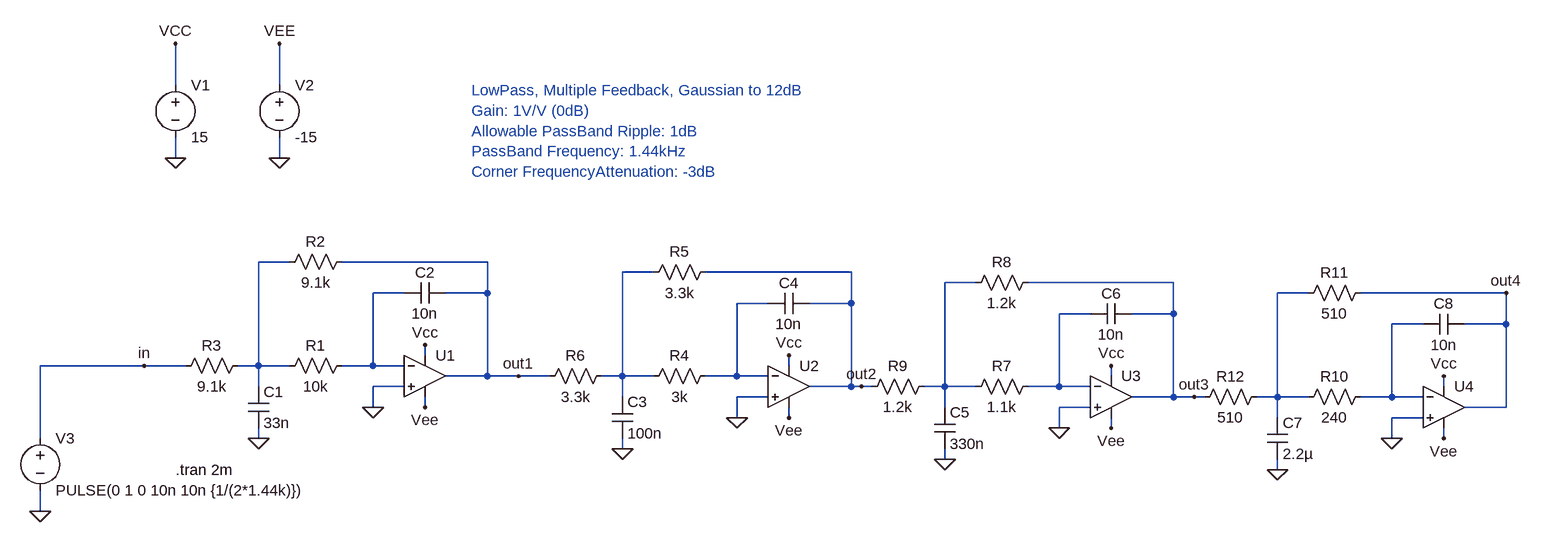
[diagram p0: schematic gaussFilter.asc]
gaussFilter.asc, the LTspice schematic file:
Version 4
SHEET 1 1868 680
WIRE -224 -144 -224 -208
WIRE -64 -144 -64 -208
WIRE -224 -32 -224 -64
WIRE -64 -32 -64 -64
WIRE -48 128 -96 128
WIRE 256 128 32 128
WIRE 512 144 464 144
WIRE 816 144 592 144
WIRE 1008 160 960 160
WIRE 1312 160 1088 160
WIRE 128 176 80 176
WIRE 256 176 256 128
WIRE 256 176 192 176
WIRE 1520 176 1472 176
WIRE 1824 176 1600 176
WIRE 688 192 640 192
WIRE 816 192 816 144
WIRE 816 192 752 192
WIRE 1184 208 1136 208
WIRE 1312 208 1312 160
WIRE 1312 208 1248 208
WIRE 1696 224 1648 224
WIRE 1824 224 1824 176
WIRE 1824 224 1760 224
WIRE 160 272 160 256
WIRE -272 288 -432 288
WIRE -208 288 -272 288
WIRE -96 288 -96 128
WIRE -96 288 -128 288
WIRE -48 288 -96 288
WIRE 80 288 80 176
WIRE 80 288 32 288
WIRE 128 288 80 288
WIRE 720 288 720 272
WIRE 256 304 256 176
WIRE 256 304 192 304
WIRE 304 304 256 304
WIRE 352 304 304 304
WIRE 464 304 464 144
WIRE 464 304 432 304
WIRE 512 304 464 304
WIRE 640 304 640 192
WIRE 640 304 592 304
WIRE 688 304 640 304
WIRE 1216 304 1216 288
WIRE -96 320 -96 288
WIRE 128 320 80 320
WIRE 816 320 816 192
WIRE 816 320 752 320
WIRE 832 320 816 320
WIRE 848 320 832 320
WIRE 960 320 960 160
WIRE 960 320 928 320
WIRE 1008 320 960 320
WIRE 1136 320 1136 208
WIRE 1136 320 1088 320
WIRE 1184 320 1136 320
WIRE 1728 320 1728 304
WIRE 464 336 464 304
WIRE 688 336 640 336
WIRE 1312 336 1312 208
WIRE 1312 336 1248 336
WIRE 1344 336 1312 336
WIRE 1360 336 1344 336
WIRE 1472 336 1472 176
WIRE 1472 336 1440 336
WIRE 1520 336 1472 336
WIRE 1648 336 1648 224
WIRE 1648 336 1600 336
WIRE 1696 336 1648 336
WIRE 80 352 80 320
WIRE 160 352 160 336
WIRE 960 352 960 320
WIRE 1184 352 1136 352
WIRE 1824 352 1824 224
WIRE 1824 352 1760 352
WIRE 640 368 640 336
WIRE 720 368 720 352
WIRE 1472 368 1472 336
WIRE 1696 368 1648 368
WIRE 1136 384 1136 352
WIRE 1216 384 1216 368
WIRE -432 400 -432 288
WIRE -96 400 -96 384
WIRE 1648 400 1648 368
WIRE 1728 400 1728 384
WIRE 464 416 464 400
WIRE 960 432 960 416
WIRE 1472 448 1472 432
WIRE -432 512 -432 480
FLAG 160 256 Vcc
FLAG 160 352 Vee
FLAG -224 -32 0
FLAG -64 -32 0
FLAG -224 -208 VCC
FLAG -64 -208 VEE
FLAG -96 400 0
FLAG 80 352 0
FLAG 720 272 Vcc
FLAG 720 368 Vee
FLAG 464 416 0
FLAG 640 368 0
FLAG 1216 288 Vcc
FLAG 1216 384 Vee
FLAG 960 432 0
FLAG 1136 384 0
FLAG 1728 304 Vcc
FLAG 1728 400 Vee
FLAG 1472 448 0
FLAG 1648 400 0
FLAG -272 288 in
FLAG 304 304 out1
FLAG 832 320 out2
FLAG 1344 336 out3
FLAG 1824 176 out4
FLAG -432 512 0
SYMBOL Opamps\\UniversalOpamp2 160 304 R0
SYMATTR InstName U1
SYMBOL voltage -224 -160 R0
WINDOW 123 0 0 Left 2
WINDOW 39 0 0 Left 2
SYMATTR InstName V1
SYMATTR Value 15
SYMBOL voltage -64 -160 R0
WINDOW 123 0 0 Left 2
WINDOW 39 0 0 Left 2
SYMATTR InstName V2
SYMATTR Value -15
SYMBOL res 48 272 R90
WINDOW 0 0 56 VBottom 2
WINDOW 3 32 56 VTop 2
SYMATTR InstName R1
SYMATTR Value 10k
SYMBOL res 48 112 R90
WINDOW 0 0 56 VBottom 2
WINDOW 3 32 56 VTop 2
SYMATTR InstName R2
SYMATTR Value 9.1k
SYMBOL res -112 272 R90
WINDOW 0 0 56 VBottom 2
WINDOW 3 32 56 VTop 2
SYMATTR InstName R3
SYMATTR Value 9.1k
SYMBOL cap -112 320 R0
SYMATTR InstName C1
SYMATTR Value 33n
SYMBOL cap 192 160 R90
WINDOW 0 0 32 VBottom 2
WINDOW 3 32 32 VTop 2
SYMATTR InstName C2
SYMATTR Value 10n
SYMBOL Opamps\\UniversalOpamp2 720 320 R0
SYMATTR InstName U2
SYMBOL res 608 288 R90
WINDOW 0 0 56 VBottom 2
WINDOW 3 32 56 VTop 2
SYMATTR InstName R4
SYMATTR Value 3k
SYMBOL res 608 128 R90
WINDOW 0 0 56 VBottom 2
WINDOW 3 32 56 VTop 2
SYMATTR InstName R5
SYMATTR Value 3.3k
SYMBOL res 448 288 R90
WINDOW 0 0 56 VBottom 2
WINDOW 3 32 56 VTop 2
SYMATTR InstName R6
SYMATTR Value 3.3k
SYMBOL cap 448 336 R0
SYMATTR InstName C3
SYMATTR Value 100n
SYMBOL cap 752 176 R90
WINDOW 0 0 32 VBottom 2
WINDOW 3 32 32 VTop 2
SYMATTR InstName C4
SYMATTR Value 10n
SYMBOL Opamps\\UniversalOpamp2 1216 336 R0
SYMATTR InstName U3
SYMBOL res 1104 304 R90
WINDOW 0 0 56 VBottom 2
WINDOW 3 32 56 VTop 2
SYMATTR InstName R7
SYMATTR Value 1.1k
SYMBOL res 1104 144 R90
WINDOW 0 0 56 VBottom 2
WINDOW 3 32 56 VTop 2
SYMATTR InstName R8
SYMATTR Value 1.2k
SYMBOL res 944 304 R90
WINDOW 0 0 56 VBottom 2
WINDOW 3 32 56 VTop 2
SYMATTR InstName R9
SYMATTR Value 1.2k
SYMBOL cap 944 352 R0
SYMATTR InstName C5
SYMATTR Value 330n
SYMBOL cap 1248 192 R90
WINDOW 0 0 32 VBottom 2
WINDOW 3 32 32 VTop 2
SYMATTR InstName C6
SYMATTR Value 10n
SYMBOL Opamps\\UniversalOpamp2 1728 352 R0
SYMATTR InstName U4
SYMBOL res 1616 320 R90
WINDOW 0 0 56 VBottom 2
WINDOW 3 32 56 VTop 2
SYMATTR InstName R10
SYMATTR Value 240
SYMBOL res 1616 160 R90
WINDOW 0 0 56 VBottom 2
WINDOW 3 32 56 VTop 2
SYMATTR InstName R11
SYMATTR Value 510
SYMBOL res 1456 320 R90
WINDOW 0 0 56 VBottom 2
WINDOW 3 32 56 VTop 2
SYMATTR InstName R12
SYMATTR Value 510
SYMBOL cap 1456 368 R0
SYMATTR InstName C7
SYMATTR Value 2.2µ
SYMBOL cap 1760 208 R90
WINDOW 0 0 32 VBottom 2
WINDOW 3 32 32 VTop 2
SYMATTR InstName C8
SYMATTR Value 10n
SYMBOL voltage -432 384 R0
WINDOW 123 0 0 Left 2
WINDOW 39 0 0 Left 2
SYMATTR InstName V3
SYMATTR Value PULSE(0 1 0 10n 10n {1/(2*1.44k)})
TEXT -224 448 Left 2 !.tran 2m
TEXT 232 -136 Left 2 ;LowPass, Multiple Feedback, Gaussian to 12dB\nGain: 1V/V (0dB)\nAllowable PassBand Ripple: 1dB\nPassBand Frequency: 1.44kHz\nCorner FrequencyAttenuation: -3dB

The netlist it stands for:
* gaussFilter.asc
XU1 0 N004 Vcc Vee out1 level.2 Avol=1Meg GBW=10Meg Slew=10Meg ilimit=25m rail=0 Vos=0 phimargin=45 en=0 enk=0 in=0 ink=0 Rin=500Meg  ; pins IN+ IN- V+ V- OUT
V1 Vcc 0 15
V2 Vee 0 -15
R1 N004 N001 10k
R2 out1 N001 9.1k
R3 N001 in 9.1k
C1 N001 0 33n
C2 out1 N004 10n
XU2 0 N006 Vcc Vee out2 level.2 Avol=1Meg GBW=10Meg Slew=10Meg ilimit=25m rail=0 Vos=0 phimargin=45 en=0 enk=0 in=0 ink=0 Rin=500Meg  ; pins IN+ IN- V+ V- OUT
R4 N006 N002 3k
R5 out2 N002 3.3k
R6 N002 out1 3.3k
C3 N002 0 100n
C4 out2 N006 10n
XU3 0 N007 Vcc Vee out3 level.2 Avol=1Meg GBW=10Meg Slew=10Meg ilimit=25m rail=0 Vos=0 phimargin=45 en=0 enk=0 in=0 ink=0 Rin=500Meg  ; pins IN+ IN- V+ V- OUT
R7 N007 N003 1.1k
R8 out3 N003 1.2k
R9 N003 out2 1.2k
C5 N003 0 330n
C6 out3 N007 10n
XU4 0 N008 Vcc Vee out4 level.2 Avol=1Meg GBW=10Meg Slew=10Meg ilimit=25m rail=0 Vos=0 phimargin=45 en=0 enk=0 in=0 ink=0 Rin=500Meg  ; pins IN+ IN- V+ V- OUT
R10 N008 N005 240
R11 out4 N005 510
R12 N005 out3 510
C7 N005 0 2.2µ
C8 out4 N008 10n
V3 in 0 PULSE(0 1 0 10n 10n {1/(2*1.44k)})
.tran 2m
* LowPass, Multiple Feedback, Gaussian to 12dB
* Gain: 1V/V (0dB)
* Allowable PassBand Ripple: 1dB
* PassBand Frequency: 1.44kHz
* Corner FrequencyAttenuation: -3dB
.lib UniversalOpamps2.sub
.backanno
.end